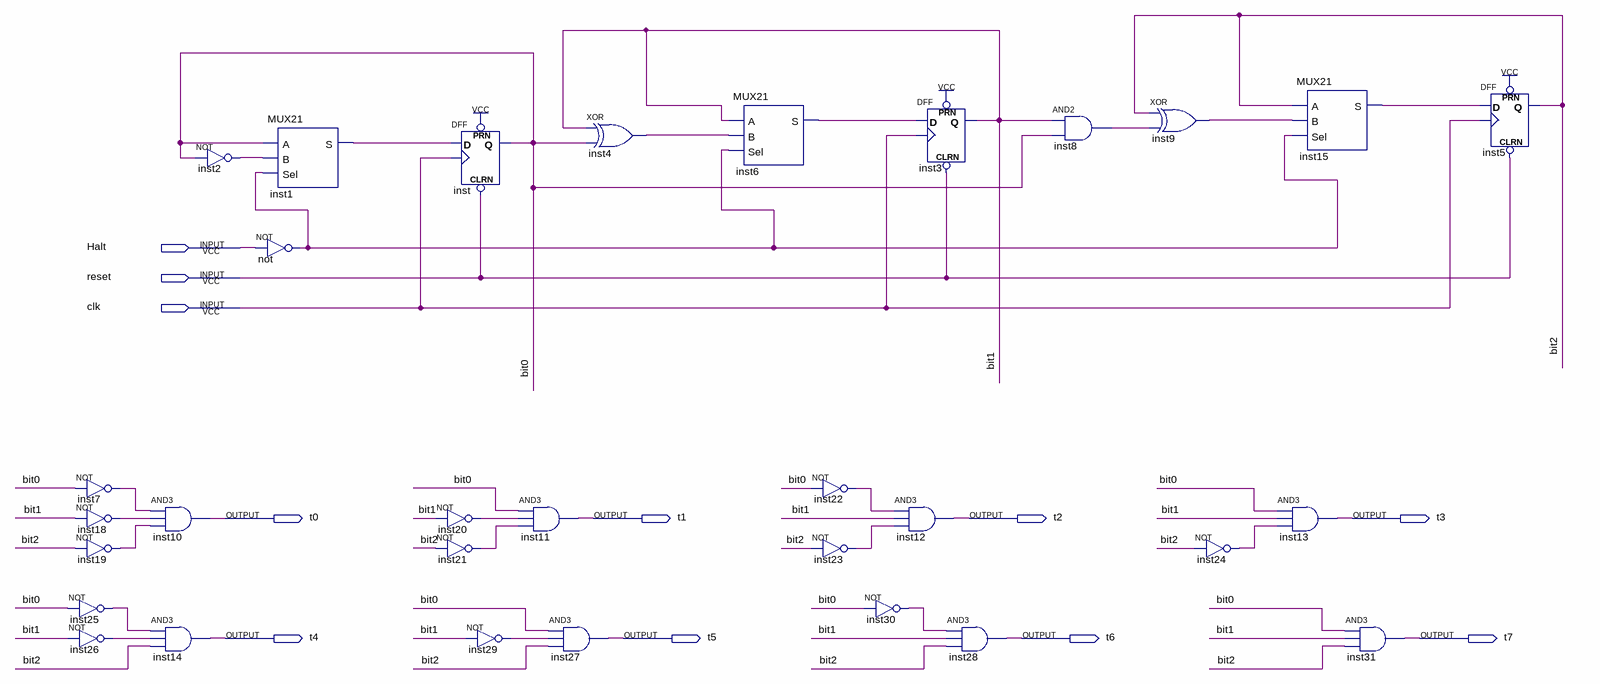
[diagram p0: schematic sheet]
// Quartus schematic Contador3bits.bdf as structural Verilog: 31 symbols, 11 pins
module Contador3bits (
  input  Halt,
  input  reset,
  input  clk,
  output t0,
  output t1,
  output t2,
  output t3,
  output t4,
  output t5,
  output t6,
  output t7
);

  wire bit0, bit1, bit2, inst1_s, inst2_out, inst4_out, inst6_s, inst7_out, inst8_out, inst9_out, inst15_s,
       inst18_out, inst19_out, inst20_out, inst21_out, inst22_out, inst23_out, inst24_out, inst25_out,
       inst26_out, inst29_out, inst30_out, not_out;

  not inst7 (inst7_out, bit0);
  not inst18 (inst18_out, bit1);
  not inst19 (inst19_out, bit2);
  not inst25 (inst25_out, bit0);
  not inst26 (inst26_out, bit1);
  and inst10 (t0, inst7_out, inst18_out, inst19_out);
  and inst14 (t4, inst25_out, inst26_out, bit2);
  not inst2 (inst2_out, bit0);
  MUX21 inst1 (.A(bit0), .B(inst2_out), .Sel(not_out), .S(inst1_s));
  not \not  (not_out, Halt);
  DFF inst (.CLRN(reset), .CLK(clk), .D(inst1_s), .PRN(1'b1), .Q(bit0));
  not inst20 (inst20_out, bit1);
  not inst21 (inst21_out, bit2);
  not inst29 (inst29_out, bit1);
  and inst11 (t1, bit0, inst20_out, inst21_out);
  xor inst4 (inst4_out, bit1, bit0);
  and inst27 (t5, bit0, inst29_out, bit2);
  MUX21 inst6 (.A(bit1), .B(inst4_out), .Sel(not_out), .S(inst6_s));
  not inst22 (inst22_out, bit0);
  not inst23 (inst23_out, bit2);
  not inst30 (inst30_out, bit0);
  DFF inst3 (.CLRN(reset), .CLK(clk), .D(inst6_s), .PRN(1'b1), .Q(bit1));
  and inst12 (t2, inst22_out, bit1, inst23_out);
  and inst28 (t6, inst30_out, bit1, bit2);
  and inst8 (inst8_out, bit1, bit0);
  xor inst9 (inst9_out, bit2, inst8_out);
  not inst24 (inst24_out, bit2);
  MUX21 inst15 (.A(bit2), .B(inst9_out), .Sel(not_out), .S(inst15_s));
  and inst13 (t3, bit0, bit1, inst24_out);
  and inst31 (t7, bit0, bit1, bit2);
  DFF inst5 (.CLRN(reset), .CLK(clk), .D(inst15_s), .PRN(1'b1), .Q(bit2));
endmodule
